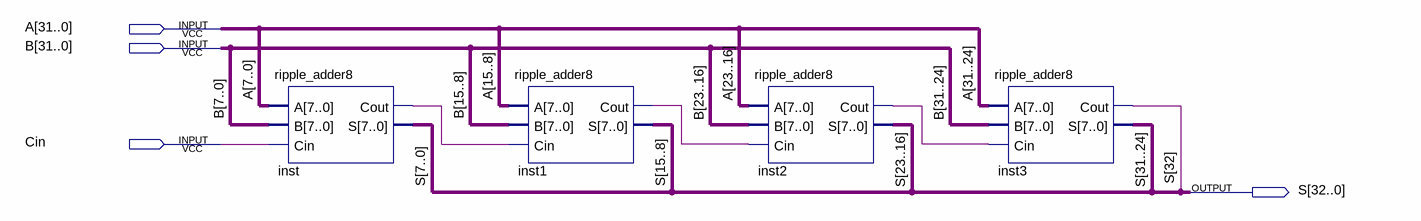
[diagram p0: schematic sheet]
// Quartus schematic cra32.bdf as structural Verilog: 4 symbols, 4 pins
module cra32 (
  input  [31:0] A,
  input  [31:0] B,
  input  Cin,
  output [32:0] S
);

  wire inst1_cout, inst2_cout, inst_cout;

  ripple_adder8 inst (.A(A[7:0]), .B(B[7:0]), .Cin(Cin), .Cout(inst_cout), .S(S[7:0]));
  ripple_adder8 inst1 (.A(A[15:8]), .B(B[15:8]), .Cin(inst_cout), .Cout(inst1_cout), .S(S[15:8]));
  ripple_adder8 inst2 (.A(A[23:16]), .B(B[23:16]), .Cin(inst1_cout), .Cout(inst2_cout), .S(S[23:16]));
  ripple_adder8 inst3 (.A(A[31:24]), .B(B[31:24]), .Cin(inst2_cout), .Cout(S[32]), .S(S[31:24]));
endmodule
